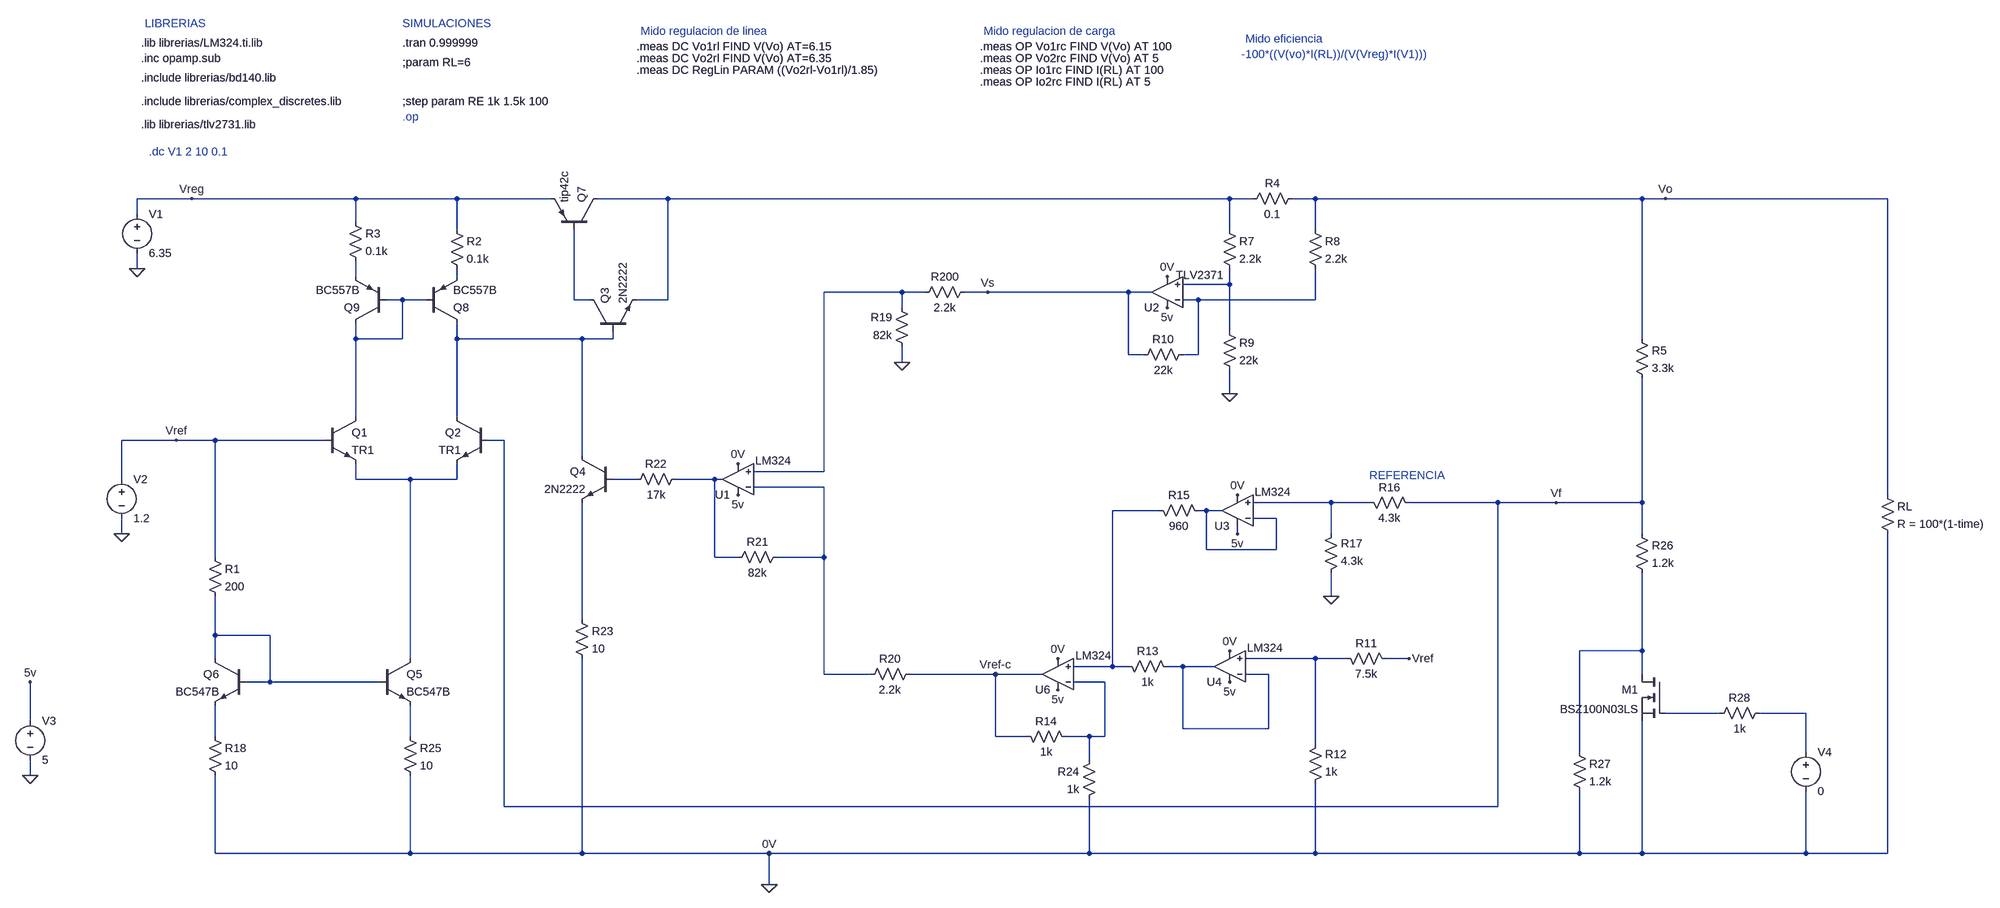
[diagram p0: schematic reguladorA.asc]
reguladorA.asc, the LTspice schematic file:
Version 4
SHEET 1 4368 1556
WIRE -208 -336 -320 -336
WIRE 128 -336 -208 -336
WIRE 336 -336 128 -336
WIRE 528 -336 336 -336
WIRE 768 -336 624 -336
WIRE 1920 -336 768 -336
WIRE 1968 -336 1920 -336
WIRE 2096 -336 2048 -336
WIRE 2784 -336 2096 -336
WIRE 2832 -336 2784 -336
WIRE 3376 -336 2832 -336
WIRE -320 -304 -320 -336
WIRE 128 -288 128 -336
WIRE 336 -272 336 -336
WIRE 1920 -272 1920 -336
WIRE 2096 -272 2096 -336
WIRE -320 -192 -320 -224
WIRE 128 -176 128 -208
WIRE 336 -176 336 -192
WIRE 1920 -160 1920 -192
WIRE 1920 -160 1824 -160
WIRE 1248 -144 1088 -144
WIRE 1296 -144 1248 -144
WIRE 1424 -144 1376 -144
WIRE 1712 -144 1424 -144
WIRE 1760 -144 1712 -144
WIRE 224 -128 192 -128
WIRE 272 -128 224 -128
WIRE 576 -128 576 -272
WIRE 608 -128 576 -128
WIRE 768 -128 768 -336
WIRE 768 -128 704 -128
WIRE 1856 -128 1824 -128
WIRE 2096 -128 2096 -192
WIRE 2096 -128 1856 -128
WIRE 1248 -112 1248 -144
WIRE 1920 -64 1920 -160
WIRE 128 -48 128 -80
WIRE 224 -48 224 -128
WIRE 224 -48 128 -48
WIRE 336 -48 336 -80
WIRE 592 -48 336 -48
WIRE 656 -48 656 -64
WIRE 656 -48 592 -48
WIRE 2784 -48 2784 -336
WIRE 1712 -16 1712 -144
WIRE 1744 -16 1712 -16
WIRE 1856 -16 1856 -128
WIRE 1856 -16 1824 -16
WIRE 1248 0 1248 -32
WIRE 1920 64 1920 16
WIRE 128 112 128 -48
WIRE 336 112 336 -48
WIRE -240 160 -352 160
WIRE -160 160 -240 160
WIRE 64 160 -160 160
WIRE 432 160 400 160
WIRE 592 192 592 -48
WIRE 1088 224 1088 -144
WIRE 1088 224 944 224
WIRE -352 240 -352 160
WIRE 128 240 128 208
WIRE 240 240 128 240
WIRE 336 240 336 208
WIRE 336 240 240 240
WIRE 704 240 656 240
WIRE 864 240 784 240
WIRE 880 240 864 240
WIRE 1088 256 944 256
WIRE 3376 272 3376 -336
WIRE 2128 288 1968 288
WIRE 2208 288 2128 288
WIRE 2480 288 2288 288
WIRE 2608 288 2480 288
WIRE 2784 288 2784 32
WIRE 2784 288 2608 288
WIRE 1776 304 1680 304
WIRE 1872 304 1856 304
WIRE 1904 304 1872 304
WIRE 2016 320 1968 320
WIRE -352 352 -352 320
WIRE 1936 352 1936 336
WIRE 2128 352 2128 288
WIRE 2784 352 2784 288
WIRE 1872 384 1872 304
WIRE 2016 384 2016 320
WIRE 2016 384 1872 384
WIRE -160 400 -160 160
WIRE 864 400 864 240
WIRE 912 400 864 400
WIRE 1088 400 1088 256
WIRE 1088 400 992 400
WIRE 2128 480 2128 432
WIRE 592 528 592 288
WIRE -160 560 -160 480
WIRE -48 560 -160 560
WIRE 2784 592 2784 432
WIRE 2784 592 2656 592
WIRE -160 608 -160 560
WIRE 240 608 240 240
WIRE 2096 608 1952 608
WIRE 2160 608 2096 608
WIRE 2288 608 2240 608
WIRE 1680 624 1680 304
WIRE 1680 624 1600 624
WIRE 1712 624 1680 624
WIRE 1824 624 1792 624
WIRE 1888 624 1824 624
WIRE 1088 640 1088 400
WIRE 1184 640 1088 640
WIRE 1440 640 1264 640
WIRE 1536 640 1440 640
WIRE 2000 640 1952 640
WIRE 2784 640 2784 592
WIRE -48 656 -48 560
WIRE -48 656 -96 656
WIRE 176 656 -48 656
WIRE 1664 656 1600 656
WIRE 2944 720 2832 720
WIRE 3120 720 3024 720
WIRE -896 736 -896 656
WIRE 1824 752 1824 624
WIRE 2000 752 2000 640
WIRE 2000 752 1824 752
WIRE -160 768 -160 704
WIRE 240 768 240 704
WIRE 1440 768 1440 640
WIRE 1504 768 1440 768
WIRE 1632 768 1584 768
WIRE 1664 768 1664 656
WIRE 1664 768 1632 768
WIRE 2096 784 2096 608
WIRE 2656 800 2656 592
WIRE 3120 800 3120 720
WIRE 1632 816 1632 768
WIRE -896 848 -896 816
WIRE 432 912 432 160
WIRE 2480 912 2480 288
WIRE 2480 912 432 912
WIRE -160 1008 -160 848
WIRE 240 1008 240 848
WIRE 240 1008 -160 1008
WIRE 592 1008 592 608
WIRE 592 1008 240 1008
WIRE 976 1008 592 1008
WIRE 1632 1008 1632 896
WIRE 1632 1008 976 1008
WIRE 2096 1008 2096 864
WIRE 2096 1008 1632 1008
WIRE 2656 1008 2656 880
WIRE 2656 1008 2096 1008
WIRE 2784 1008 2784 736
WIRE 2784 1008 2656 1008
WIRE 3120 1008 3120 880
WIRE 3120 1008 2784 1008
WIRE 3376 1008 3376 352
WIRE 3376 1008 3120 1008
WIRE 976 1072 976 1008
FLAG 976 1072 0
FLAG -320 -192 0
FLAG -352 352 0
FLAG -208 -336 Vreg
FLAG -240 160 Vref
FLAG 1424 -144 Vs
FLAG 2128 480 0
FLAG 1440 640 Vref-c
FLAG 1248 0 0
FLAG 2288 608 Vref
FLAG 2608 288 Vf
FLAG 1920 64 0
FLAG 976 1008 0V
FLAG 1792 -176 0V
FLAG 912 208 0V
FLAG 1936 272 0V
FLAG 1920 592 0V
FLAG 1568 608 0V
FLAG -896 848 0
FLAG -896 656 5v
FLAG 1936 352 5v
FLAG 1792 -112 5v
FLAG 1920 656 5v
FLAG 1568 672 5v
FLAG 912 272 5v
FLAG 2832 -336 Vo
DATAFLAG 16 160 ""
DATAFLAG 336 -16 ""
DATAFLAG 128 32 ""
DATAFLAG 3296 -336 ""
DATAFLAG 1824 -336 ""
DATAFLAG 1632 -144 ""
DATAFLAG 1088 160 ""
DATAFLAG 1088 304 ""
DATAFLAG 816 240 ""
DATAFLAG 2512 288 ""
DATAFLAG 2096 688 ""
DATAFLAG 1840 624 ""
DATAFLAG 1360 640 ""
SYMBOL npn 64 112 R0
SYMATTR InstName Q1
SYMATTR Value TR1
SYMBOL npn 400 112 M0
SYMATTR InstName Q2
SYMATTR Value TR1
SYMBOL npn 608 -64 R270
SYMATTR InstName Q3
SYMATTR Value 2N2222
SYMBOL npn 176 608 R0
SYMATTR InstName Q5
SYMATTR Value BC547B
SYMBOL npn -96 608 M0
SYMATTR InstName Q6
SYMATTR Value BC547B
SYMBOL res -176 384 R0
SYMATTR InstName R1
SYMATTR Value 200
SYMBOL res 320 -288 R0
SYMATTR InstName R2
SYMATTR Value 0.1k
SYMBOL res 112 -304 R0
SYMATTR InstName R3
SYMATTR Value 0.1k
SYMBOL res 3360 256 R0
SYMATTR InstName RL
SYMATTR Value R = 100*(1-time)
SYMBOL pnp 624 -272 M270
SYMATTR InstName Q7
SYMATTR Value tip42c
SYMBOL pnp 272 -80 M180
SYMATTR InstName Q8
SYMATTR Value BC557B
SYMBOL pnp 192 -80 R180
SYMATTR InstName Q9
SYMATTR Value BC557B
SYMBOL voltage -320 -320 R0
WINDOW 123 0 0 Left 0
WINDOW 39 0 0 Left 0
SYMATTR InstName V1
SYMATTR Value 6.35
SYMBOL voltage -352 224 R0
WINDOW 123 0 0 Left 0
WINDOW 39 0 0 Left 0
SYMATTR InstName V2
SYMATTR Value 1.2
SYMBOL res 1904 -288 R0
SYMATTR InstName R7
SYMATTR Value 2.2k
SYMBOL res 2080 -288 R0
SYMATTR InstName R8
SYMATTR Value 2.2k
SYMBOL res 1904 -80 R0
SYMATTR InstName R9
SYMATTR Value 22k
SYMBOL res 1840 -32 R90
WINDOW 0 0 56 VBottom 2
WINDOW 3 32 56 VTop 2
SYMATTR InstName R10
SYMATTR Value 22k
SYMBOL res 2144 592 M90
WINDOW 0 0 56 VBottom 2
WINDOW 3 32 56 VTop 2
SYMATTR InstName R11
SYMATTR Value 7.5k
SYMBOL res 2080 880 M180
WINDOW 0 36 76 Left 2
WINDOW 3 36 40 Left 2
SYMATTR InstName R12
SYMATTR Value 1k
SYMBOL res 1696 608 M90
WINDOW 0 0 56 VBottom 2
WINDOW 3 32 56 VTop 2
SYMATTR InstName R13
SYMATTR Value 1k
SYMBOL res 1488 752 M90
WINDOW 0 0 56 VBottom 2
WINDOW 3 32 56 VTop 2
SYMATTR InstName R14
SYMATTR Value 1k
SYMBOL res 1760 288 M90
WINDOW 0 0 56 VBottom 2
WINDOW 3 32 56 VTop 2
SYMATTR InstName R15
SYMATTR Value 960
SYMBOL res 2192 272 M90
WINDOW 0 0 56 VBottom 2
WINDOW 3 32 56 VTop 2
SYMATTR InstName R16
SYMATTR Value 4.3k
SYMBOL res 2112 448 M180
WINDOW 0 36 76 Left 2
WINDOW 3 36 40 Left 2
SYMATTR InstName R17
SYMATTR Value 4.3k
SYMBOL res 1168 656 R270
WINDOW 0 32 56 VTop 2
WINDOW 3 0 56 VBottom 2
SYMATTR InstName R20
SYMATTR Value 2.2k
SYMBOL res 800 224 R90
WINDOW 0 0 56 VBottom 2
WINDOW 3 32 56 VTop 2
SYMATTR InstName R22
SYMATTR Value 17k
SYMBOL res 576 512 R0
SYMATTR InstName R23
SYMATTR Value 10
SYMBOL res 1648 800 M0
SYMATTR InstName R24
SYMATTR Value 1k
SYMBOL res 896 416 R270
WINDOW 0 32 56 VTop 2
WINDOW 3 0 56 VBottom 2
SYMATTR InstName R21
SYMATTR Value 82k
SYMBOL res 1392 -160 R90
WINDOW 0 0 56 VBottom 2
WINDOW 3 32 56 VTop 2
SYMATTR InstName R200
SYMATTR Value 2.2k
SYMBOL res 1264 -16 R180
WINDOW 0 36 76 Left 2
WINDOW 3 36 40 Left 2
SYMATTR InstName R19
SYMATTR Value 82k
SYMBOL res 1952 -320 R270
WINDOW 0 32 56 VTop 2
WINDOW 3 0 56 VBottom 2
SYMATTR InstName R4
SYMATTR Value 0.1
SYMBOL npn 656 192 M0
SYMATTR InstName Q4
SYMATTR Value 2N2222
SYMBOL res -176 752 R0
SYMATTR InstName R18
SYMATTR Value 10
SYMBOL res 224 752 R0
SYMATTR InstName R25
SYMATTR Value 10
SYMBOL OpAmps\\opamp2 1568 704 R180
WINDOW 3 -110 102 Left 2
SYMATTR Value LM324
SYMATTR InstName U6
SYMBOL OpAmps\\opamp2 1792 -80 R180
WINDOW 3 -116 99 Left 2
SYMATTR Value TLV2371
SYMATTR InstName U2
SYMBOL OpAmps\\opamp2 912 304 R180
WINDOW 3 -110 102 Left 2
SYMATTR Value LM324
SYMATTR InstName U1
SYMBOL OpAmps\\opamp2 1936 368 R180
WINDOW 3 -110 102 Left 2
SYMATTR Value LM324
SYMATTR InstName U3
SYMBOL OpAmps\\opamp2 1920 688 R180
WINDOW 3 -110 102 Left 2
SYMATTR Value LM324
SYMATTR InstName U4
SYMBOL voltage -896 720 R0
WINDOW 123 0 0 Left 0
WINDOW 39 0 0 Left 0
SYMATTR InstName V3
SYMATTR Value 5
SYMBOL res 2768 -64 R0
SYMATTR InstName R5
SYMATTR Value 3.3k
SYMBOL res 2768 336 R0
SYMATTR InstName R26
SYMATTR Value 1.2k
SYMBOL nmos 2832 640 M0
SYMATTR InstName M1
SYMATTR Value BSZ100N03LS
SYMBOL res 3040 704 R90
WINDOW 0 0 56 VBottom 2
WINDOW 3 32 56 VTop 2
SYMATTR InstName R28
SYMATTR Value 1k
SYMBOL voltage 3120 784 R0
WINDOW 123 0 0 Left 0
WINDOW 39 0 0 Left 0
SYMATTR InstName V4
SYMATTR Value 0
SYMBOL res 2640 784 R0
SYMATTR InstName R27
SYMATTR Value 1.2k
TEXT 224 -536 Left 2 !;step param RE 1k 1.5k 100
TEXT 224 -616 Left 2 !;param RL=6
TEXT 224 -656 Left 2 !.tran 0.999999
TEXT -312 -584 Left 2 !.include librerias/bd140.lib
TEXT -312 -536 Left 2 !.include librerias/complex_discretes.lib
TEXT 224 -504 Left 2 ;.op
TEXT 2360 232 Right 2 ;REFERENCIA
TEXT -312 -624 Left 2 !.inc opamp.sub
TEXT -312 -656 Left 2 !.lib librerias/LM324.ti.lib
TEXT -304 -696 Left 2 ;LIBRERIAS
TEXT 224 -696 Left 2 ;SIMULACIONES
TEXT 704 -648 Left 2 !.meas DC Vo1rl FIND V(Vo) AT=6.15
TEXT 704 -624 Left 2 !.meas DC Vo2rl FIND V(Vo) AT=6.35
TEXT 704 -600 Left 2 !.meas DC RegLin PARAM ((Vo2rl-Vo1rl)/1.85)
TEXT 712 -680 Left 2 ;Mido regulacion de linea
TEXT 1408 -648 Left 2 !.meas OP Vo1rc FIND V(Vo) AT 100
TEXT 1408 -624 Left 2 !.meas OP Vo2rc FIND V(Vo) AT 5
TEXT 1408 -600 Left 2 !.meas OP Io1rc FIND I(RL) AT 100
TEXT 1408 -576 Left 2 !.meas OP Io2rc FIND I(RL) AT 5
TEXT 1416 -680 Left 2 ;Mido regulacion de carga
TEXT 1944 -632 Left 2 ;-100*((V(vo)*I(RL))/(V(Vreg)*I(V1)))
TEXT 1952 -664 Left 2 ;Mido eficiencia
TEXT -296 -432 Left 2 ;.dc V1 2 10 0.1
TEXT -312 -488 Left 2 !.lib librerias/tlv2731.lib

The netlist it stands for:
* reguladorA.asc
Q1 N006 Vref N010 0 TR1
Q2 N009 Vf N010 0 TR1
Q3 N007 N009 N001 0 2N2222
Q5 N010 N018 N026 0 BC547B
Q6 N018 N018 N025 0 BC547B
R1 Vref N018 200
R2 Vreg N003 0.1k
R3 Vreg N002 0.1k
RL Vo 0 R = 100*(1-time)
Q7 N001 N007 Vreg 0 tip42c
Q8 N009 N006 N003 0 BC557B
Q9 N006 N006 N002 0 BC557B
V1 Vreg 0 6.35
V2 Vref 0 1.2
R7 N001 N004 2.2k
R8 Vo N008 2.2k
R9 N004 0 22k
R10 N008 Vs 22k
R11 N020 Vref 7.5k
R12 0 N020 1k
R13 N015 N021 1k
R14 Vref-c N022 1k
R15 N015 N016 960
R16 N014 Vf 4.3k
R17 0 N014 4.3k
R20 N013 Vref-c 2.2k
R22 N012 N011 17k
R23 N017 0 10
R24 N022 0 1k
R21 N012 N013 82k
R200 Vs N005 2.2k
R19 0 N005 82k
R4 N001 Vo 0.1
Q4 N009 N011 N017 0 2N2222
R18 N025 0 10
R25 N026 0 10
XU6 N015 N022 5v 0 Vref-c LM324  ; pins In+ In- V+ V- OUT
XU2 N004 N008 5v 0 Vs TLV2371  ; pins In+ In- V+ V- OUT
XU1 N005 N013 5v 0 N012 LM324  ; pins In+ In- V+ V- OUT
XU3 N014 N016 5v 0 N016 LM324  ; pins In+ In- V+ V- OUT
XU4 N020 N021 5v 0 N021 LM324  ; pins In+ In- V+ V- OUT
V3 5v 0 5
R5 Vo Vf 3.3k
R26 Vf N019 1.2k
M1 N019 N023 0 0 BSZ100N03LS
R28 N024 N023 1k
V4 N024 0 0
R27 N019 0 1.2k
.model NPN NPN
.model PNP PNP
.lib standard.bjt
.model NMOS NMOS
.model PMOS PMOS
.lib standard.mos
;step param RE 1k 1.5k 100
;param RL=6
.tran 0.999999
.include librerias/bd140.lib
.include librerias/complex_discretes.lib
* .op
* REFERENCIA
.inc opamp.sub
.lib librerias/LM324.ti.lib
* LIBRERIAS
* SIMULACIONES
.meas DC Vo1rl FIND V(Vo) AT=6.15
.meas DC Vo2rl FIND V(Vo) AT=6.35
.meas DC RegLin PARAM ((Vo2rl-Vo1rl)/1.85)
* Mido regulacion de linea
.meas OP Vo1rc FIND V(Vo) AT 100
.meas OP Vo2rc FIND V(Vo) AT 5
.meas OP Io1rc FIND I(RL) AT 100
.meas OP Io2rc FIND I(RL) AT 5
* Mido regulacion de carga
* -100*((V(vo)*I(RL))/(V(Vreg)*I(V1)))
* Mido eficiencia
* .dc V1 2 10 0.1
.lib librerias/tlv2731.lib
.backanno
.end